# EAGLE design Dyno (EAGLE 9.6.2)
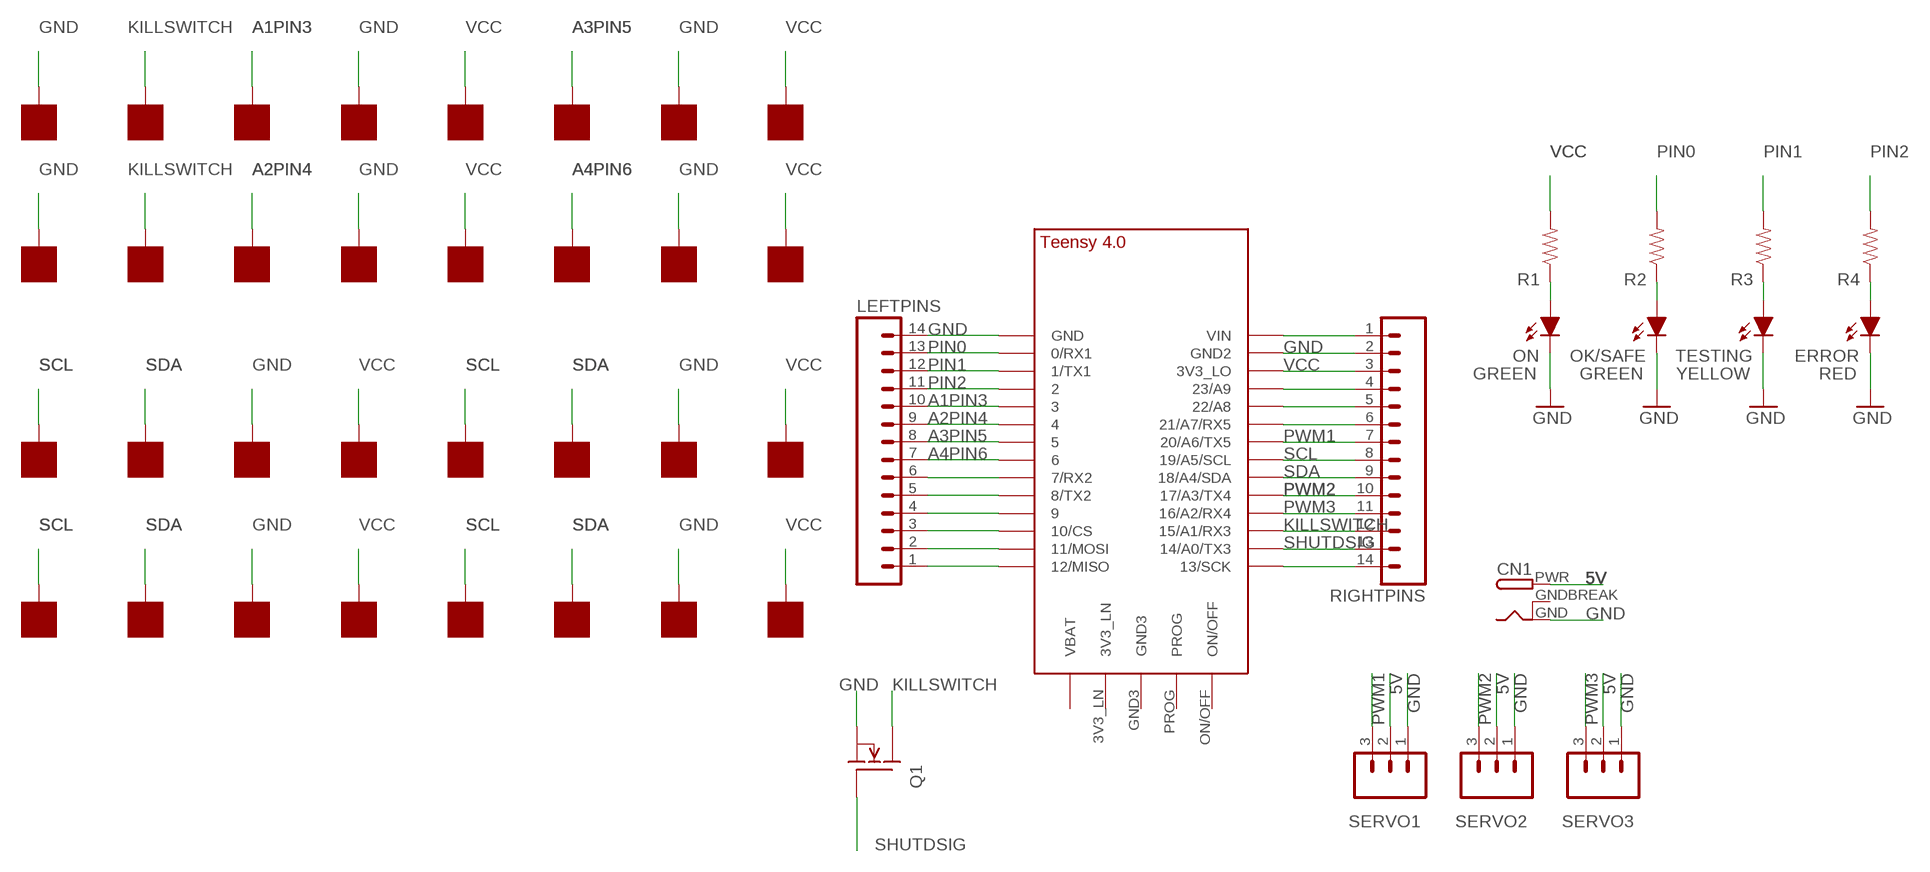
[diagram p0: schematic, sheet 1]

## Parts
A1  SOLDER_PAD  [SOLDER_PAD_XSMALL]
A1GND  SOLDER_PAD  [SOLDER_PAD_XSMALL]
A1VCC  SOLDER_PAD  [SOLDER_PAD_XSMALL]
A2  SOLDER_PAD  [SOLDER_PAD_XSMALL]
A2GND  SOLDER_PAD  [SOLDER_PAD_XSMALL]
A2VCC  SOLDER_PAD  [SOLDER_PAD_XSMALL]
A3  SOLDER_PAD  [SOLDER_PAD_XSMALL]
A3GND  SOLDER_PAD  [SOLDER_PAD_XSMALL]
A3VCC  SOLDER_PAD  [SOLDER_PAD_XSMALL]
A4  SOLDER_PAD  [SOLDER_PAD_XSMALL]
A4GND  SOLDER_PAD  [SOLDER_PAD_XSMALL]
A4VCC  SOLDER_PAD  [SOLDER_PAD_XSMALL]
CN1  DCBARRELPTH  [DCJACK_2MM_PTH]
EMERGENCYSTOPBUTTON  SOLDER_PAD  [SOLDER_PAD_XSMALL]
ERROR  RED  LED-5MM  [LED-5MM]
GNDBUTTON  SOLDER_PAD  [SOLDER_PAD_XSMALL]
GNDKILL  SOLDER_PAD  [SOLDER_PAD_XSMALL]
I2CGND1  SOLDER_PAD  [SOLDER_PAD_XSMALL]
I2CGND2  SOLDER_PAD  [SOLDER_PAD_XSMALL]
I2CGND3  SOLDER_PAD  [SOLDER_PAD_XSMALL]
I2CGND4  SOLDER_PAD  [SOLDER_PAD_XSMALL]
I2CVCC1  SOLDER_PAD  [SOLDER_PAD_XSMALL]
I2CVCC2  SOLDER_PAD  [SOLDER_PAD_XSMALL]
I2CVCC3  SOLDER_PAD  [SOLDER_PAD_XSMALL]
I2CVCC4  SOLDER_PAD  [SOLDER_PAD_XSMALL]
KILLSWITCH  SOLDER_PAD  [SOLDER_PAD_XSMALL]
LEFTPINS  M14  [14P]
OK/SAFE  GREEN  LED-5MM  [LED-5MM]
ON  GREEN  LED-5MM  [LED-5MM]
Q1  DMG3406LSOT  [SOT23]
R1  RESISTOR0603-RES  [0603-RES]
R2  RESISTOR0603-RES  [0603-RES]
R3  RESISTOR0603-RES  [0603-RES]
R4  RESISTOR0603-RES  [0603-RES]
RIGHTPINS  M14  [14P]
SCL1  SOLDER_PAD  [SOLDER_PAD_XSMALL]
SCL2  SOLDER_PAD  [SOLDER_PAD_XSMALL]
SCL3  SOLDER_PAD  [SOLDER_PAD_XSMALL]
SCL4  SOLDER_PAD  [SOLDER_PAD_XSMALL]
SDA1  SOLDER_PAD  [SOLDER_PAD_XSMALL]
SDA2  SOLDER_PAD  [SOLDER_PAD_XSMALL]
SDA3  SOLDER_PAD  [SOLDER_PAD_XSMALL]
SDA4  SOLDER_PAD  [SOLDER_PAD_XSMALL]
SERVO1  M03  [1X03]
SERVO2  M03  [1X03]
SERVO3  M03  [1X03]
TESTING  YELLOW  LED-5MM  [LED-5MM]
U$1  TEENSY_4.0  [TEENSY_4.0]

## Nets
5V: CN1.PWR SERVO1.2 SERVO2.2 SERVO3.2
A1PIN3: A1.P$1 LEFTPINS.10 U$1.3/CANTX
A2PIN4: A2.P$1 LEFTPINS.9 U$1.4/CANRX
A3PIN5: A3.P$1 LEFTPINS.8 U$1.5
A4PIN6: A4.P$1 LEFTPINS.7 U$1.6
GND: A1GND.P$1 A2GND.P$1 A3GND.P$1 A4GND.P$1 CN1.GND ERROR.K(C) GNDBUTTON.P$1 GNDKILL.P$1 I2CGND1.P$1 I2CGND2.P$1 I2CGND3.P$1 I2CGND4.P$1 LEFTPINS.14 OK/SAFE.K(C) ON.K(C) Q1.2(S) RIGHTPINS.2 SERVO1.1 SERVO2.1 SERVO3.1 TESTING.K(C) U$1.GND U$1.GND2
KILLSWITCH: EMERGENCYSTOPBUTTON.P$1 KILLSWITCH.P$1 Q1.3(D) RIGHTPINS.12 U$1.15/A1(15/A1/RX3)
N$1: LEFTPINS.6 U$1.7(7/RX2)
N$2: LEFTPINS.5 U$1.8(8/TX2)
N$11: LEFTPINS.4 U$1.9/CS
N$12: LEFTPINS.3 U$1.10/CS
N$13: LEFTPINS.2 U$1.11/MOSI
N$14: LEFTPINS.1 U$1.12/MISO
N$15: RIGHTPINS.1 U$1.VIN
N$18: RIGHTPINS.4 U$1.23/A9
N$19: RIGHTPINS.5 U$1.22/A8
N$20: RIGHTPINS.6 U$1.21/A7(21/A7/RX5)
N$28: RIGHTPINS.14 U$1.13/SCK
N$29: ON.A R1.1
N$30: OK/SAFE.A R2.1
N$31: R3.1 TESTING.A
N$32: ERROR.A R4.1
PIN0: LEFTPINS.13 R2.2 U$1.0/RX(0/RX1)
PIN1: LEFTPINS.12 R3.2 U$1.1/TX(1/TX1)
PIN2: LEFTPINS.11 R4.2 U$1.2
PWM1: RIGHTPINS.7 SERVO1.3 U$1.20/A6(20/A6/TX5)
PWM2: RIGHTPINS.10 SERVO2.3 U$1.17/A3(17/A3/TX4)
PWM3: RIGHTPINS.11 SERVO3.3 U$1.16/A2(16/A2/RX4)
SCL: RIGHTPINS.8 SCL1.P$1 SCL2.P$1 SCL3.P$1 SCL4.P$1 U$1.19/A5/SCL
SDA: RIGHTPINS.9 SDA1.P$1 SDA2.P$1 SDA3.P$1 SDA4.P$1 U$1.18/A4/SDA
SHUTDSIG: Q1.1(G) RIGHTPINS.13 U$1.14/A0(14/A0/TX3)
VCC: A1VCC.P$1 A2VCC.P$1 A3VCC.P$1 A4VCC.P$1 I2CVCC1.P$1 I2CVCC2.P$1 I2CVCC3.P$1 I2CVCC4.P$1 R1.2 RIGHTPINS.3 U$1.3V3_LO
Unconnected: U$1.3V3_LN U$1.GND3 U$1.ON/OFF U$1.PROG U$1.VBAT\(VBAT)

## Power pins joined to a net without a drawn wire
GNDBREAK: CN1.GNDBREAK

## Library data of the parts
A1 A1GND A1VCC A2 A2GND A2VCC A3 A3GND A3VCC A4 A4GND A4VCC EMERGENCYSTOPBUTTON GNDBUTTON GNDKILL I2CGND1-I2CGND4 I2CVCC1-I2CVCC4 KILLSWITCH SCL1-SCL4 SDA1-SDA4 = HyTechDevices:SOLDER_PAD: Solder pad used to attach wires directly to PCB
CN1 = HyTechDevices:DCBARREL: 2.0mm DC Barrel Jack DCJACK_2MM_PTH - Through Hole Jack (4UConnector: 05537) Source: Adafruit <https://github.com/adafruit/Adafruit-Eagle-Library>
ERROR OK/SAFE ON TESTING = HyTechDevices:LED: Light Emitting Diode (LED) Source: Dangerous Prototypes Eagle Library <https://github.com/DangerousPrototypes/Eagle_Part_Library>
LEFTPINS RIGHTPINS = con-amp-quick:M14: AMP QUICK CONNECTOR; OC_FARNELL: unknown; OC_NEWARK: unknown
Q1 = HyTechDevices:DMG3406L: Generic NPN MOSFET DMG3406L (SOT-23, 2.8 A 30V)
R1-R4 = HyTechDevices:RESISTOR: Resistor Basic schematic elements and footprints for 0603, 1206, and PTH resistors.
SERVO1-SERVO3 = HyTechDevices:M03: Standard 3-pin 0.1" header.
U$1 = TEENSY 4.0:TEENSY_4.0

## Board
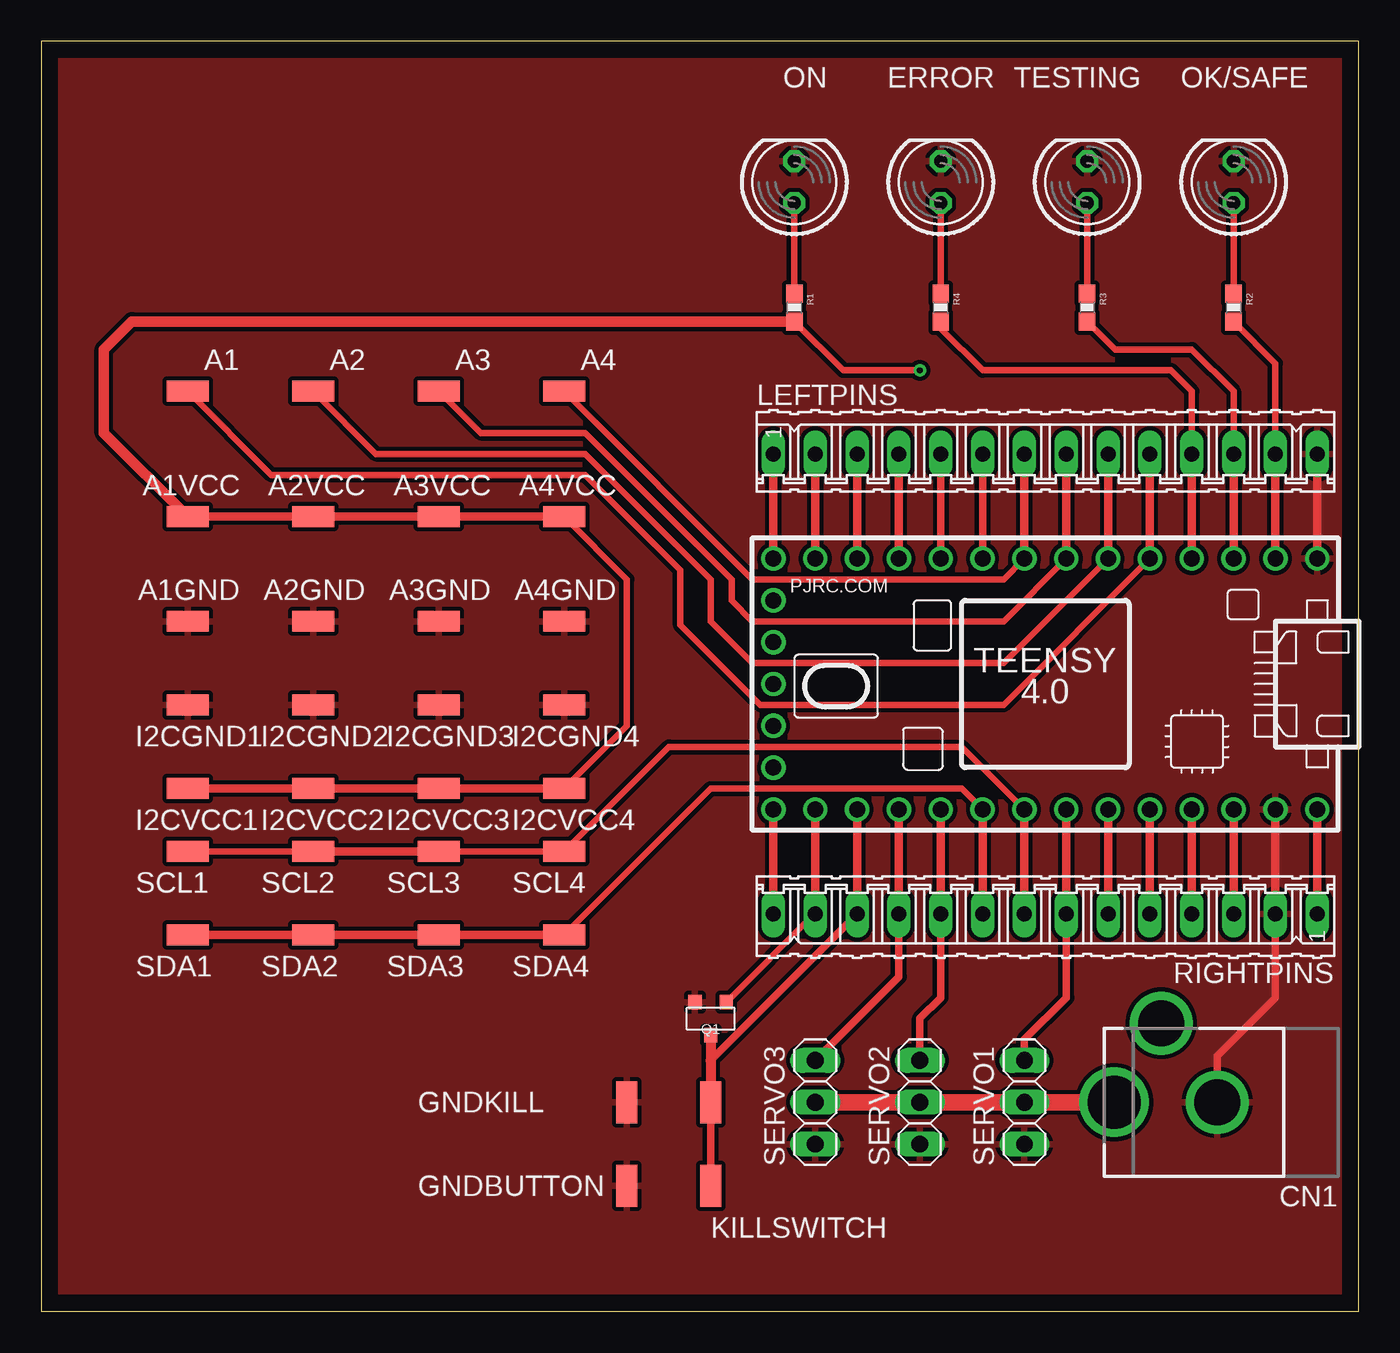
[diagram p1: board, top side]
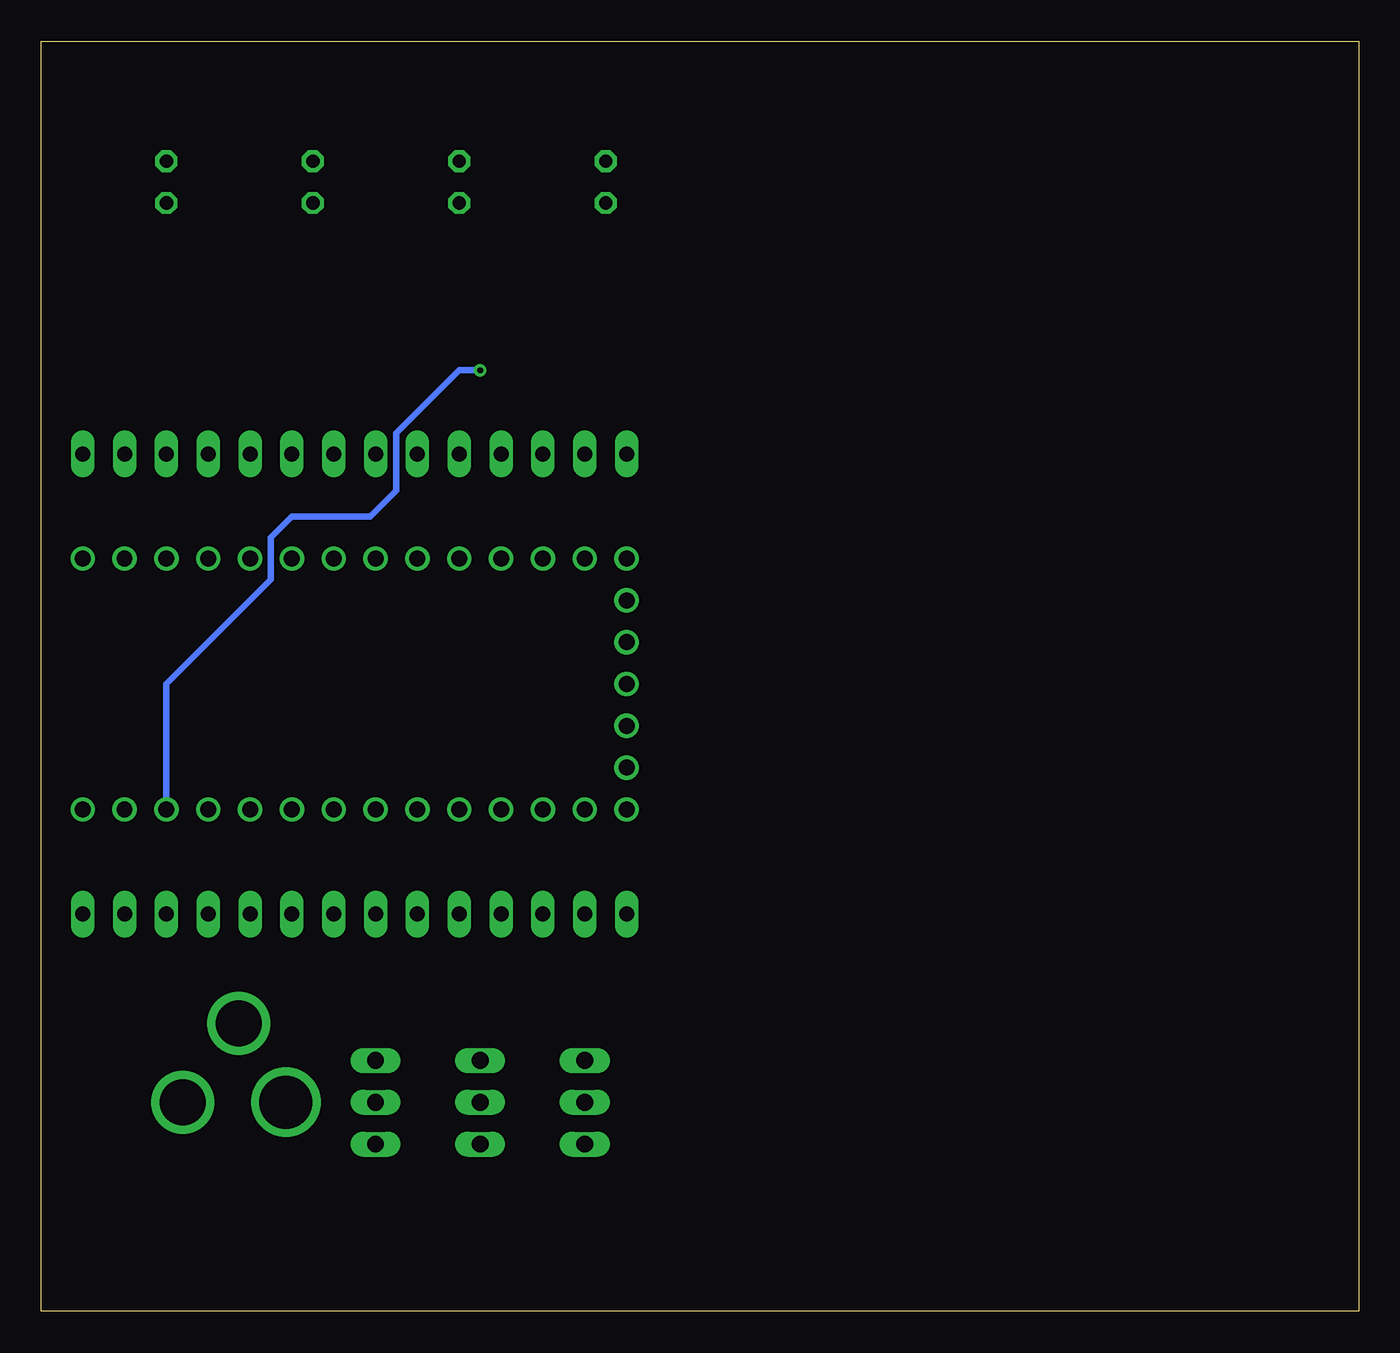
[diagram p2: board, bottom side, seen from below]

Size 79.99 x 77.14 mm. Coordinates in mm from the lower left corner, seen from the top.
Outline: 0,0 79.99,0 79.99,77.14 0,77.14 0,0
Copper layers (1*16): Top 0.035mm / dielectric 1.5mm / Bottom 0.035mm
Design rules "default *": minimum track width 6mil, minimum drill 0.35mm, track to track 10mil, track to pad 10mil, pad to pad 10mil, via to via 10mil, smd to smd 10mil, copper to edge 40mil, drill to drill 6mil, minimum pad ring 10mil, minimum via ring 8mil, stop-mask expansion 4mil, vias tented up to drill 0mil, thermal gap 10mil

### Footprints (pad centres in the part's own frame; a part is rotated, then mirrored left to right if it is on the bottom)
SOLDER_PAD_XSMALL = smd 2.54 x 1.27: P$1 0,0
DCJACK_2MM_PTH = drill 2.8: GND 0,7.35; GNDBREAK 4.8,10.75 | drill 3.2: PWR 0,13.6
LED-5MM = drill 0.813 octagon: A -1.27,0; K 1.27,0
14P = drill 0.914 long: 1 -16.51,0; 2 -13.97,0; 3 -11.43,0; 4 -8.89,0; 5 -6.35,0; 6 -3.81,0; 7 -1.27,0; 8 1.27,0; 9 3.81,0; 10 6.35,0; 11 8.89,0; 12 11.43,0; 13 13.97,0; 14 16.51,0
SOT23 = smd 0.8 x 0.9: 1 -0.95,-1; 2 0.95,-1; 3 0,1
0603-RES = smd 1.1 x 1: 1 -0.85,0; 2 0.85,0
1X03 = drill 1.016 long: 1 -2.54,0; 2 0,0; 3 2.54,0
TEENSY_4.0 = drill 0.965: 0/RX -13.97,-7.62; 1/TX -11.43,-7.62; 2 -8.89,-7.62; 3/CANTX -6.35,-7.62; 3V3_LN 16.51,-2.54; 3V3_LO -11.43,7.62; 4/CANRX -3.81,-7.62; 5 -1.27,-7.62; 6 1.27,-7.62; 7 3.81,-7.62; 8 6.35,-7.62; 9/CS 8.89,-7.62; 10/CS 11.43,-7.62; 11/MOSI 13.97,-7.62; 12/MISO 16.51,-7.62; 13/SCK 16.51,7.62; 14/A0 13.97,7.62; 15/A1 11.43,7.62; 16/A2 8.89,7.62; 17/A3 6.35,7.62; 18/A4/SDA 3.81,7.62; 19/A5/SCL 1.27,7.62; 20/A6 -1.27,7.62; 21/A7 -3.81,7.62; 22/A8 -6.35,7.62; 23/A9 -8.89,7.62; GND -16.51,-7.62; GND2 -13.97,7.62; GND3 16.51,0; ON/OFF 16.51,5.08; PROG 16.51,2.54; VBAT\ 16.51,-5.08; VIN -16.51,7.62

### Placement (x,y rotation side)
A1  8.89,55.88 180 top
A1GND  8.89,41.91 180 top
A1VCC  8.89,48.26 180 top
A2  16.51,55.88 180 top
A2GND  16.51,41.91 180 top
A2VCC  16.51,48.26 180 top
A3  24.13,55.88 180 top
A3GND  24.13,41.91 180 top
A3VCC  24.13,48.26 180 top
A4  31.75,55.88 180 top
A4GND  31.75,41.91 180 top
A4VCC  31.75,48.26 180 top
CN1  78.74,12.7 90 top
EMERGENCYSTOPBUTTON  40.64,12.7 270 top
ERROR  54.61,68.58 90 top
GNDBUTTON  35.56,7.62 270 top
GNDKILL  35.56,12.7 270 top
I2CGND1  8.89,36.83 0 top
I2CGND2  16.51,36.83 0 top
I2CGND3  24.13,36.83 0 top
I2CGND4  31.75,36.83 0 top
I2CVCC1  8.89,31.75 0 top
I2CVCC2  16.51,31.75 0 top
I2CVCC3  24.13,31.75 0 top
I2CVCC4  31.75,31.75 0 top
KILLSWITCH  40.64,7.62 270 top
LEFTPINS  60.96,52.07 0 top
OK/SAFE  72.39,68.58 90 top
ON  45.72,68.58 90 top
Q1  40.64,17.78 180 top
R1  45.72,60.96 270 top
R2  72.39,60.96 270 top
R3  63.5,60.96 270 top
R4  54.61,60.96 270 top
RIGHTPINS  60.96,24.13 180 top
SCL1  8.89,27.94 0 top
SCL2  16.51,27.94 0 top
SCL3  24.13,27.94 0 top
SCL4  31.75,27.94 0 top
SDA1  8.89,22.86 0 top
SDA2  16.51,22.86 0 top
SDA3  24.13,22.86 0 top
SDA4  31.75,22.86 0 top
SERVO1  59.69,12.7 90 top
SERVO2  53.34,12.7 90 top
SERVO3  46.99,12.7 90 top
TESTING  63.5,68.58 90 top
U$1  60.96,38.1 180 top

### Tracks (layer width: path | path; a pad name or v marks a point on that pad's centre or on a via)
5V
  Top 0.991: SERVO3.2 SERVO2.2 SERVO1.2 CN1.PWR
A1PIN3
  Top 0.406: U$1.3/CANTX 58.42,36.83 43.66,36.83 38.81,41.68 38.81,45.01 33.02,50.8 13.97,50.8 A1.P$1
  Top 0.508: U$1.3/CANTX LEFTPINS.10
A2PIN4
  Top 0.406: A2.P$1 20.32,52.07 33.02,52.07 40.64,44.45 40.64,41.91 43.18,39.37 58.42,39.37 U$1.4/CANRX
  Top 0.508: U$1.4/CANRX LEFTPINS.9
A3PIN5
  Top 0.406: A3.P$1 26.67,53.34 33.02,53.34 41.91,44.45 41.91,43.18 43.18,41.91 58.42,41.91 U$1.5
  Top 0.508: LEFTPINS.8 U$1.5
A4PIN6
  Top 0.406: A4.P$1 43.18,44.45 58.42,44.45 U$1.6
  Top 0.508: U$1.6 LEFTPINS.7
GND
  Top 0.457: CN1.GND 71.39,15.51 74.93,19.05 RIGHTPINS.2
  Top 0.508: U$1.GND LEFTPINS.14 | RIGHTPINS.2 U$1.GND2
  Top 0.762: GNDBUTTON.P$1 35.56,7.5
  pour Top: -16.51,96.52 -16.51,5.08 3.81,-15.24 78.74,-15.24 97.79,3.81 97.79,81.28 76.2,102.87 -10.16,102.87
KILLSWITCH
  Top 0.457: KILLSWITCH.P$1 EMERGENCYSTOPBUTTON.P$1 | 40.64,15.24 RIGHTPINS.12
  Top 0.508: U$1.15/A1 RIGHTPINS.12
  Top 0.61: Q1.3 40.64,15.24 EMERGENCYSTOPBUTTON.P$1
N$1
  Top 0.457: U$1.7 LEFTPINS.6
N$2
  Top 0.457: LEFTPINS.5 U$1.8
N$11
  Top 0.508: U$1.9/CS LEFTPINS.4
N$12
  Top 0.508: U$1.10/CS LEFTPINS.3
N$13
  Top 0.508: U$1.11/MOSI LEFTPINS.2
N$14
  Top 0.508: U$1.12/MISO LEFTPINS.1
N$15
  Top 0.508: RIGHTPINS.1 U$1.VIN
N$18
  Top 0.508: RIGHTPINS.4 U$1.23/A9
N$19
  Top 0.508: U$1.22/A8 RIGHTPINS.5
N$20
  Top 0.508: U$1.21/A7 RIGHTPINS.6
N$28
  Top 0.508: U$1.13/SCK RIGHTPINS.14
N$29
  Top 0.406: R1.1 ON.A
N$30
  Top 0.406: R2.1 OK/SAFE.A
N$31
  Top 0.406: R3.1 TESTING.A
N$32
  Top 0.406: R4.1 ERROR.A
PIN0
  Top 0.406: R2.2 74.93,57.57 LEFTPINS.13
  Top 0.508: U$1.0/RX LEFTPINS.13
PIN1
  Top 0.406: R3.2 65.19,58.42 69.85,58.42 72.39,55.88 LEFTPINS.12
  Top 0.508: U$1.1/TX LEFTPINS.12
PIN2
  Top 0.406: LEFTPINS.11 69.85,55.88 68.58,57.15 57.15,57.15 54.61,59.69 R4.2
  Top 0.508: U$1.2 LEFTPINS.11
PWM1
  Top 0.457: SERVO1.3 59.69,16.51 62.23,19.05 RIGHTPINS.7
  Top 0.508: U$1.20/A6 RIGHTPINS.7
PWM2
  Top 0.457: SERVO2.3 53.34,17.78 54.61,19.05 RIGHTPINS.10
  Top 0.508: U$1.17/A3 RIGHTPINS.10
PWM3
  Top 0.457: SERVO3.3 52.07,20.32 RIGHTPINS.11
  Top 0.508: RIGHTPINS.11 U$1.16/A2
SCL
  Top 0.406: SCL2.P$1 SCL1.P$1 | U$1.19/A5/SCL 55.88,34.29 38.1,34.29 SCL4.P$1 SCL3.P$1
  Top 0.508: U$1.19/A5/SCL RIGHTPINS.8 | SCL3.P$1 SCL2.P$1
SDA
  Top 0.406: SDA4.P$1 40.64,31.75 55.88,31.75 U$1.18/A4/SDA
  Top 0.508: U$1.18/A4/SDA RIGHTPINS.9 | SDA4.P$1 SDA3.P$1 SDA2.P$1 SDA1.P$1
SHUTDSIG
  Top 0.406: Q1.1 46.94,24.13
  Top 0.457: 46.94,24.13 RIGHTPINS.13
  Top 0.508: U$1.14/A0 RIGHTPINS.13
VCC  (via drill 0.35)
  Top 0.406: I2CVCC4.P$1 35.56,35.56 35.56,44.45 A4VCC.P$1 | R1.2 48.68,57.15 v53.34,57.15
  Top 0.508: U$1.3V3_LO RIGHTPINS.3 | I2CVCC4.P$1 I2CVCC3.P$1 I2CVCC2.P$1 I2CVCC1.P$1 | A4VCC.P$1 A3VCC.P$1 A2VCC.P$1 A1VCC.P$1
  Top 0.635: A1VCC.P$1 3.81,53.34 3.81,58.42 5.5,60.11 R1.2
  Bottom 0.406: U$1.3V3_LO 72.39,38.1 66.04,44.45 66.04,46.99 64.77,48.26 60.01,48.26 58.42,49.85 58.42,53.34 54.61,57.15 v53.34,57.15